# Altium schematic sheet CATS-EUROC-RF.SchDoc: CATS EuRoC Edition
size A4; Author: Luca Jost; Revision: V1.0; SheetNumber: 13; SheetTotal: 16; Subtitle: RF
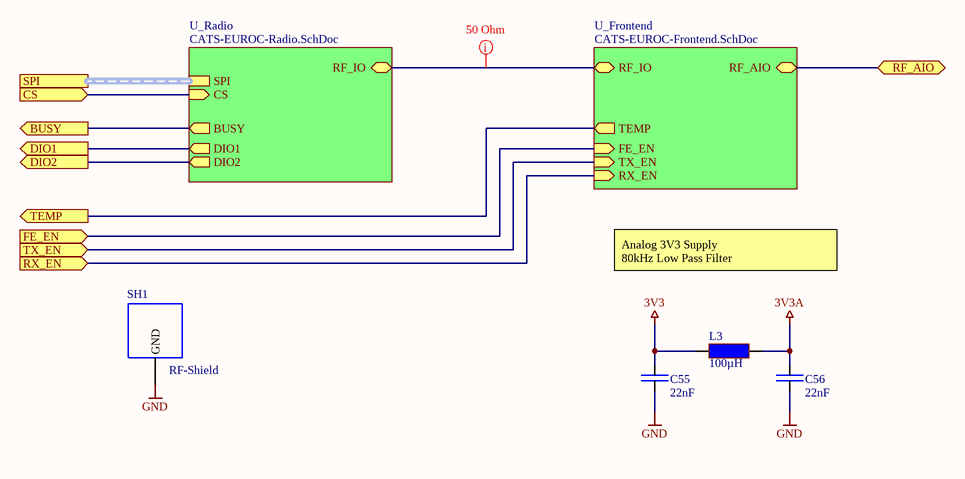
[diagram p0: CATS-EUROC-RF.SchDoc]

## Parts
C55  22nF  [SMD Keramikkondensator 0805]
C56  22nF  [SMD Keramikkondensator 0805]
L3  100µH  [SMD Inductor 1812]
SH1  RF-Shield  [SMD Shield MS183-10]

## Sub-sheets
U_Frontend = CATS-EUROC-Frontend.SchDoc: FE_EN (in), TX_EN (in), TEMP (out), RF_IO (bidir), RX_EN (in), RF_AIO (bidir)
U_Radio = CATS-EUROC-Radio.SchDoc: SPI (harness SPI), CS (in), BUSY (out), DIO1 (out), DIO2 (out), RF_IO (bidir)

## Ports
BUSY (out), CS (in), DIO1 (out), DIO2 (out), FE_EN (in), RF_AIO (bidir), RX_EN (in), SPI (harness SPI), TEMP (out), TX_EN (in)

## Nets
3V3: C55.2 L3.1
3V3A: C56.2 L3.2
GND: C55.1 C56.1 SH1.1(GND)
BUSY: port BUSY, sheet U_Radio/BUSY
CS: port CS, sheet U_Radio/CS
DIO1: port DIO1, sheet U_Radio/DIO1
DIO2: port DIO2, sheet U_Radio/DIO2
FE_EN: port FE_EN, sheet U_Frontend/FE_EN
RF_AIO: port RF_AIO, sheet U_Frontend/RF_AIO
RX_EN: port RX_EN, sheet U_Frontend/RX_EN
TEMP: port TEMP, sheet U_Frontend/TEMP
TX_EN: port TX_EN, sheet U_Frontend/TX_EN
(unnamed): sheet U_Frontend/RF_IO, sheet U_Radio/RF_IO

## Buses and harness runs
harness port SPI = sheet U_Radio/SPI

## Layout directives
rule Impedance Constraint [Min = 50.00    Max = 50.00    ]: (no net found under the mark)

## Notes on the sheet
- Analog 3V3 Supply
  80kHz Low Pass Filter
- Title
- Author:
- Subtitle
- Date:
- Rev:
- File:
- Sheet
- of

## Library data of the parts
C55 C56 = E6 - 22nF: SMD Ceramic Capacitor E6; Unit Price: 0.01; Number: -; Supplier: -; JLC: C1729
L3 = Inductor 100µH / 0.25A: 0.25A 100µH ±20% 144mΩ SMD Power Inductors; ComponentLink1Description: Datasheet; ComponentLink1URL: https://datasheet.lcsc.com/lcsc/2110081330_Sunlord-SPH252012H3R3MT_C98379.pdf; JLC: C76822
SH1 = RF-Shield 18x10mm: RF Shield Shield, 1-Piece 0.413" (10.50mm) X 0.720" (18.30mm) Non-Vented Solder; ComponentLink1Description: Datasheet; ComponentLink1URL: https://www.masach.com/media/catalog/product/file/MS183-10.pdf; Digikey: 2333-MS183-10S-ND